# EAGLE design telemetry box (EAGLE 6.3)
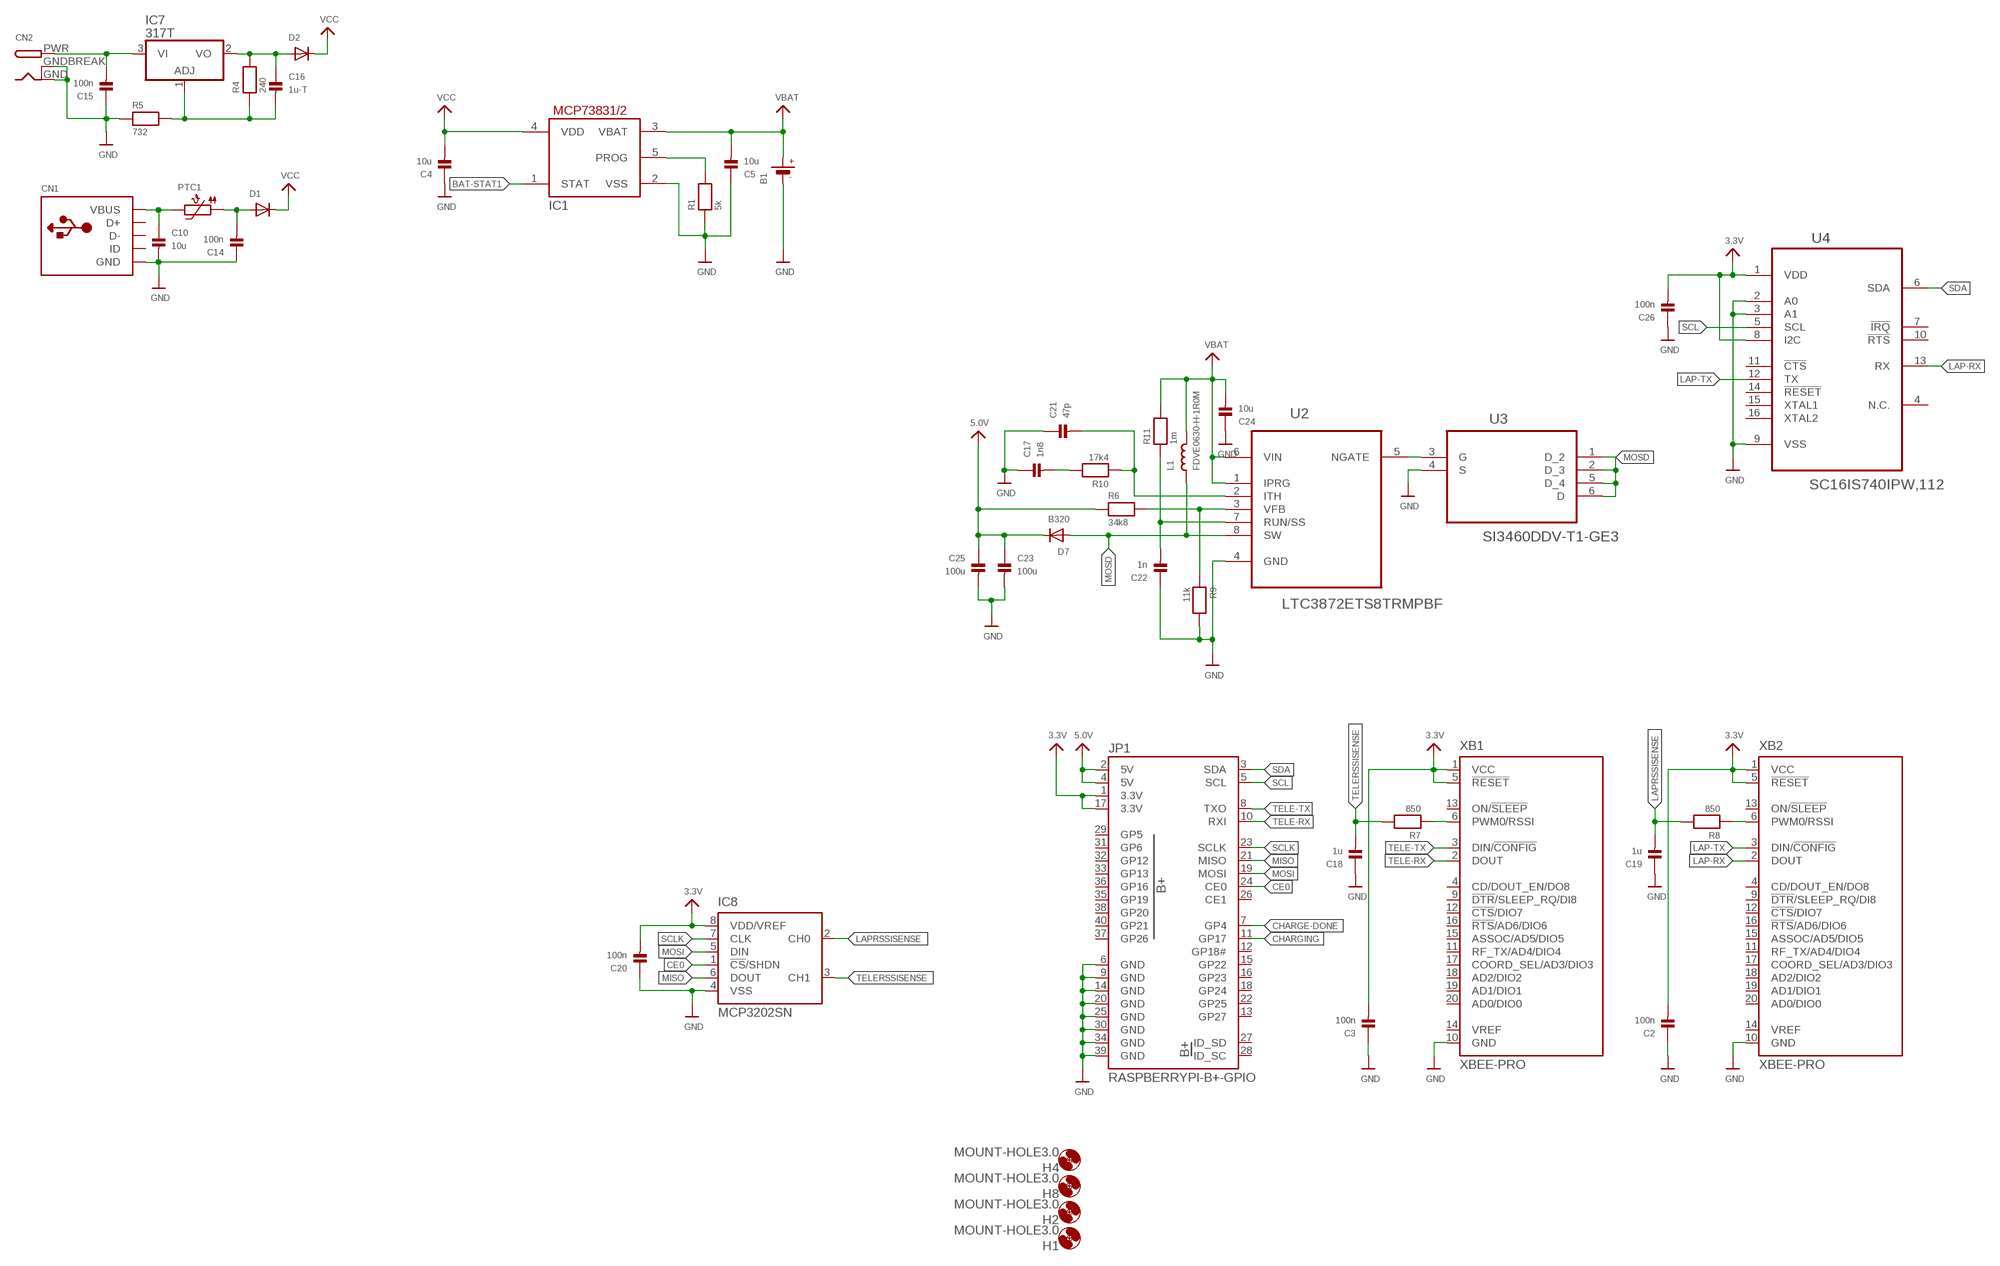
[diagram p0: schematic, sheet 1]

## Parts
B1  BATTERY  [JSTPH2]
C2  100n  CAP_CERAMIC_0603  [_0603]
C3  100n  CAP_CERAMIC_0603  [_0603]
C4  10u  CAP_CERAMIC_0805  [_0805]
C5  10u  CAP_CERAMIC_0805  [_0805]
C10  10u  CAP_CERAMIC_0805  [_0805]
C14  100n  CAP_CERAMIC_0603  [_0603]
C15  100n  CAP_CERAMIC_0603  [_0603]
C16  1u-T  CAP_CERAMIC_0603  [_0603]
C17  1n8  CAP_CERAMIC_0603  [_0603]
C18  1u  CAP_CERAMIC_0603  [_0603]
C19  1u  CAP_CERAMIC_0603  [_0603]
C20  100n  CAP_CERAMIC_0603  [_0603]
C21  47p  CAP_CERAMIC_0603  [_0603]
C22  1n  CAP_CERAMIC_0603  [_0603]
C23  100u  CAP_CERAMIC1206  [1206]
C24  10u  CAP_CERAMIC_0805  [_0805]
C25  100u  CAP_CERAMIC1206  [1206]
C26  100n  CAP_CERAMIC_0603  [_0603]
CN1  USBMINIB  [USB-MINIB]
CN2  DCBARRELPTH  [DCJACK_2MM_PTH]
D1  DIODESOT23_WAVE  [SOT23-W]
D2  DIODESOT23_WAVE  [SOT23-W]
D7  B320  DIODESMA  [SMADIODE]
H1  MOUNT-HOLE3.0  [3,0]
H2  MOUNT-HOLE3.0  [3,0]
H4  MOUNT-HOLE3.0  [3,0]
H8  MOUNT-HOLE3.0  [3,0]
IC1  MCP73831/OT  [SOT23-5L]
IC7  317T  [TO220H]
IC8  MCP3202SN  [SO-08]
JP1  RASPBERRYPI-B+-GPIO  [2X20-SHROUDED]
L1  FDVE0630-H-1R0M  INDUCTORTDK_SLF6045  [INDUCTOR_6X6MM_TDK_SLF6045]
PTC1  PTC1206  [1206]
R1  5k  RESISTOR_0603  [_0603]
R4  240  RESISTOR_0603  [_0603]
R5  732  RESISTOR_0603  [_0603]
R6  34k8  RESISTOR_0603  [_0603]
R7  850  RESISTOR_0603  [_0603]
R8  850  RESISTOR_0603  [_0603]
R9  11k  RESISTOR_0603  [_0603]
R10  17k4  RESISTOR_0603  [_0603]
R11  1m  RESISTOR_0603  [_0603]
U2  LTC3872ETS8TRMPBF  [SOT65P280X100-8N]
U3  SI3460DDV-T1-GE3  SI3457CDV-T1-GE3  [SOT95P285X110-6N]
U4  SC16IS740IPW,112  [SOP65P640X110-16N]
XB1  XBEE-PRO  [XBEE-PRO]
XB2  XBEE-PRO  [XBEE-PRO]

## Nets
3.3V: C2.2 C3.2 C20.2 C26.2 IC8.8(VDD/VREF) JP1.1(3.3V) JP1.17(3.3V) U4.1(VDD) U4.8(I2C) XB1.1(VCC) XB1.5(!RESET) XB2.1(VCC) XB2.5(!RESET)
5.0V: C23.1 C25.1 D7.C JP1.2(5V) JP1.4(5V) R6.1
BAT-STAT1: IC1.1(STAT)
CE0: IC8.1(!CS!/SHDN) JP1.24(CE0)
CHARGE-DONE: JP1.7(GP4)
CHARGING: JP1.11(GP17)
GND: B1.1(-) C2.1 C3.1 C4.1 C5.1 C10.2 C14.1 C15.1 C17.1 C18.1 C19.1 C20.1 C21.1 C22.1 C23.2 C24.1 C25.2 C26.1 CN1.GND CN2.GND CN2.GNDBREAK IC1.2(VSS) IC8.4(VSS) JP1.6(GND) JP1.9(GND) JP1.14(GND) JP1.20(GND) JP1.25(GND) JP1.30(GND) JP1.34(GND) JP1.39(GND) R1.1 R5.1 R9.2 U2.4(GND) U3.4(S) U4.2(A0) U4.3(A1) U4.9(VSS) XB1.10(GND) XB2.10(GND)
LAP-RX: U4.13(RX) XB2.2(DOUT)
LAP-TX: U4.12(TX) XB2.3(DIN/!CONFIG)
LAPRSSISENSE: C19.2 IC8.2(CH0) R8.2
MISO: IC8.6(DOUT) JP1.21(MISO)
MOSD: D7.A L1.P$1 U2.8(SW) U3.1(D_2) U3.2(D_3) U3.5(D_4) U3.6(D)
MOSI: IC8.5(DIN) JP1.19(MOSI)
N$2: IC1.5(PROG) R1.2
N$17: C10.1 CN1.VBUS PTC1.2
N$18: C16.2 IC7.1(ADJ) R4.1 R5.2
N$19: R6.2 R9.1 U2.3(VFB)
N$20: C16.1 D2.1(A) IC7.2(VO) R4.2
N$21: C14.2 D1.1(A) PTC1.1
N$22: C15.2 CN2.PWR IC7.3(VI)
N$23: R7.1 XB1.6(PWM0/RSSI)
N$24: R8.1 XB2.6(PWM0/RSSI)
N$25: U2.5(NGATE) U3.3(G)
N$26: C17.2 R10.2
N$27: C21.2 R10.1 U2.2(ITH)
N$29: C22.2 R11.1 U2.7(RUN/SS)
SCL: JP1.5(SCL) U4.5(SCL)
SCLK: IC8.7(CLK) JP1.23(SCLK)
SDA: JP1.3(SDA) U4.6(SDA)
TELE-RX: JP1.10(RXI) XB1.2(DOUT)
TELE-TX: JP1.8(TXO) XB1.3(DIN/!CONFIG)
TELERSSISENSE: C18.2 IC8.3(CH1) R7.2
VBAT: B1.2(+) C5.2 C24.2 IC1.3(VBAT) L1.P$2 R11.2 U2.1(IPRG) U2.6(VIN)
VCC: C4.2 D1.3(C) D2.3(C) IC1.4(VDD)
Unconnected: CN1.D+ CN1.D- CN1.ID JP1.12(GP18#) JP1.13(GP27) JP1.15(GP22) JP1.16(GP23) JP1.18(GP24) JP1.22(GP25) JP1.26(CE1) JP1.27(ID_SD) JP1.28(ID_SC) JP1.29(GP5) JP1.31(GP6) JP1.32(GP12) JP1.33(GP13) JP1.35(GP19) JP1.36(GP16) JP1.37(GP26) JP1.38(GP20) JP1.40(GP21) U4.4(N.C.) U4.7(!IRQ) U4.10(!RTS) U4.11(!CTS) U4.14(!RESET) U4.15(XTAL1) U4.16(XTAL2) XB1.4(CD/DOUT_EN/DO8) XB1.9(!DTR!/SLEEP_RQ/DI8) XB1.11(RF_TX/AD4/DIO4) XB1.12(!CTS!/DIO7) XB1.13(ON/!SLEEP) XB1.14(VREF) XB1.15(ASSOC/AD5/DIO5) XB1.16(!RTS!/AD6/DIO6) XB1.17(COORD_SEL/AD3/DIO3) XB1.18(AD2/DIO2) XB1.19(AD1/DIO1) XB1.20(AD0/DIO0) XB2.4(CD/DOUT_EN/DO8) XB2.9(!DTR!/SLEEP_RQ/DI8) XB2.11(RF_TX/AD4/DIO4) XB2.12(!CTS!/DIO7) XB2.13(ON/!SLEEP) XB2.14(VREF) XB2.15(ASSOC/AD5/DIO5) XB2.16(!RTS!/AD6/DIO6) XB2.17(COORD_SEL/AD3/DIO3) XB2.18(AD2/DIO2) XB2.19(AD1/DIO1) XB2.20(AD0/DIO0)

## Library data of the parts
B1 = microbuilder:BATTERY: CR1220 SMT - Digikey: 3001K-ND
C2-C5 C10 C14-C26 = microbuilder:CAP_CERAMIC: Ceramic Capacitors 0402 - 0402 Surface Mount Capacitors 16pF 50V 5% [Digikey: 445-4899-2-ND] 18pF 50V 5% [Digikey: 490-1281-2-ND] 22pF 50V 5% [Digikey: 490-1283-2-ND] 68pF 50V 5% [Digikey: 490-1289-2-ND] 0.1uF 10V 10% [Digikey: 490-1318-2-ND] 1.0uF 6.3V 10% [Digikey: 490-1320-2-ND] 0603 - 0603 Surface Mount Capacitors 16 pF 50V 5% [Digikey: 445-5051-2-ND] 22 pF 50V [Digikey: PCC220ACVTR-ND] 33 pF 50V 5% [Digikey: 490-1415-1-ND] 56pF 50V 5% [Digikey: 490-1421-1-ND] 220pF 50V 5% [Digikey: 445-1285-1-ND] 680 pF 50V 2200 pF 50V 5% C0G [Digikey: 445-1297-1-ND] 5600 pF 100V 5% X7R [Digikey: 478-3711-1-ND] 0.1 µF 25V 10% [Digikey: PCC2277TR-ND] 0.22 µF 16V 10% X7R [Digikey: 445-1318-1-ND] 1.0 µF 25V 10% [Digikey: 445-5146-2-ND] 0603 - RF Specific 3pF 250V +/-0.1pF RF [Digikey: 712-1347-1-ND] 18 pF 250V 5% [Digikey: 478-3505-1-ND or 712-1322-1-ND] 56 pF 250V 5% C0G RF [Digikey: 490-4867-1-ND] 68 pF 250V RF [Digikey: 490-4868-1-ND] 0805 - 0805 Surface Mount Capacitors 220 pF 250V 2% RF Ceramic Capacitor [Digikey: 712-1398-1-ND] 1000 pF 50V 2% NP0 Ceramic Capacitor [Digikey: 478-3760-1-ND] 0.1 µF 25V 10% Ceramic Capacitor [Digikey: PCC1828TR-ND] 1.0 µF 16V 10% Ceramic Capacitor[Digikey: 490-1691-2-ND] 10.0 µF 10V 10% Ceramic Capacitor[Digikey: 709-1228-1-ND] 10.0 uF 16V 10% Ceramic Capacitor [Digikey: 478-5165-2-ND] 47 uF 6.3V 20% Ceramic Capacitor [Digikey: 587-1779-1-ND or 399-5506-1-ND] 1206 - 1206 Surface Mount Capacitors 47uF 10V 20% Ceramic Capacitor [Digikey: 490-5528-1-ND or 399-5508-1-ND or 445-6010-1-ND] 100uF 6.3V -20%, +80% Y5V Ceramic Capacitor (Digikey: 490-4512-1-ND, Mouser: 81-GRM31CF50J107ZE1L)
CN1 = adafruit:USB: USB Connectors USBMINIB - Surface Mount Female Mini-B USB Connector 4UConnector: 06564 By microbuilder.eu Thru-hole RA Female Mini-B USB Connector 4UConnector: 18732 By ladyada.net
CN2 = adafruit:DCBARREL: 2.0mm DC Barrel Jack DCJACK_2MM_PTH - Through Hole Jack (4UConnector: 05537)
D1 D2 D7 = adafruit:DIODE: Diode SMADIODE - SMA Surface Mount Package 20V 1A Schottky Diode Digikey: 641-1014-6-ND DO-1N4148 - Through Hole Small Current Diode SOD-123 20V 1 A (.5mV Vf) Schottky Diode - Digikey: MBRX120TPMSCT-ND SOD-323 10V 570mA (.38mV Vf, 3ns) Schottky Diode - Digikey: ZLLS410CT-ND SOD-523 30V 30mA Schottky Diode (RB751S-40TE61) - Digikey: RB751S-40TE61CT-ND SOT23-R/W - SOT23 Package (R = Solder Paste/Reflow Ovens, W = Hand-Soldering) BAT54Film 40V 300mA - Digikey: 497-7162-1-ND
H1 H2 H4 H8 = holes:MOUNT-HOLE: MOUNTING HOLE with drill center marker
IC1 = adafruit:MCP73831: MCP73831/2 Miniature Single-Cell, Fully Integrated Li-Ion, Li-Polymer Charge Management Controllers. Nice and small simple lipoly charge controller, with adjustable current and status output (LED) http://www.ladyada.net/library/pcb/eaglelibrary.html
IC7 = linear:*317: Positive VOLTAGE REGULATOR
IC8 = microchip:MCP3202: 2.7V Dual Channel 12-Bit A/D Converter with SPI Serial Interface Source: http://ww1.microchip.com/downloads/en/DeviceDoc/21034D.pdf; MF: MICROCHIP; MPN: MCP3202-CI/SN; OC_FARNELL: 1196803; OC_NEWARK: 19C7207
JP1 = SparkFun-Boards:RASPBERRYPI-B+-GPIO: Raspberry Pi B+ GPIO Header 2x20 pin connector
L1 = microbuilder:INDUCTOR: Inductors 0603: 10nH Ceramic Inductor - microwire antenna/RF (Digikey: 712-1434-2-ND) 0805: 560nH Ceramic Inductor - RF (Digikey: 553-1047-1-ND) 270nH Ceramic Inductor - Q = 40@250MHz, +-5%, 1 Ohm DC Resistance (Digikey: 535-10506-2-ND) 1007 (2518 Metric) SMT: 10µH 10% 250mOhm 820mA 1007 Inductor (Digikey: 587-2189-1-ND) 22µH 10% 500mOhm 580mA 1007 Inductor (Digikey: 587-2190-1-ND) 47µH 10% 950mOhm 420mA 1007 Inductor (Digikey: 587-2191-1-ND) 47µH 5% 100mOhm 1A 1008 Inductor (Digikey: 732-1816-1-ND) 5.0x5.0mm (Taiyo Yuden NR5040 Series) 6.8µH 20% 2.3A 64mOhm Inductor (Digikey: 587-2374-2-ND) 5.0x5.0mm (TDK VLC5045 Series) 4.7µH 20% 3.3A 34mOhm Inductor (Digikey: 445-6526-1-ND) 6.8µH 20% 2.7A 46mOhm Inductor (Digikey: 445-6527-1-ND) 6.0x6.0mm (TDK VLC6045 Series) 4.7µH 20% 3.8A 27mOhm Inductor (Digikey: 445-6538-2-ND) 6.8µH 20% 3A 41mOhm Inductor (Digikey: 445-6540-1-ND) 6.2µH 30% 2.2A 45mOhm Inductor (Digikey: SRR5028-6R2YCT-ND) - Not TDK VLC6045 but footprint should match 6.0x6.0mm (TDK SLF6045 Series) 6.8uH 30% 2A 33mOhm Inductor (Digikey: 445-4572-1-ND, Mouser: 810-SLF645T6R8N2R0PF)
PTC1 = microbuilder:PTC: PTC (Resettable Fuse) 1206 Package 250mA PTC (16V Max, Time-to-Trip: 0.08s) - Digikey: F2110CT-ND 1210 Package 100mA PTC (30V Max, Time-to-Trip: 0.6s) - Digikey: MF-USMF010-2CT-ND 1812 Package 750mA PTC (24V Max, Time-to-Trip: 0.2s) - Digikey: MF-MSMF075/24-2CT-ND
R1 R4-R11 = microbuilder:RESISTOR: Resistors 0402 - 0402 Surface Mount Package 22 Ohm 1% 1/16W [Digikey: 311-22.0LRTR-ND] 33 Ohm 5% 1/16W 1.0K 5% 1/16W 1.5K 5% 1/16W 2.0K 1% 1/16W 10.0K 1% 1/16W [Digikey: 311-10.0KLRTR-ND] 10.0K 5% 1/16W [Digikey: RMCF0402JT10K0TR-ND] 12.1K 1% 1/16W [Digikey: 311-22.0LRTR-ND] 100.0K 5% 1/16W 0603 - 0603 Surface Mount Package 0 Ohm 1/10 Watt 1% Resistor 15 Ohm 1/10 Watt 1% Resistor 33 Ohm 1/10 Watt 1% Resistor 49.9 Ohm 1/10 Watt 1% Resistor 100 Ohm 1/10 Watt 1% Resistor 150 Ohm 1/10 Watt 1% Resistor 240 Ohm 1/10 Watt 1% Resistor 390 Ohm 1/10 Watt 1% Resistor 560 Ohm 1/10 Watt 1% Resistor 680 Ohm 1/10 Watt 1% Resistor 750 Ohm 1/10 Watt 1% Resistor 1.0K Ohm 1/10 Watt 1% Resistor 1.5K Ohm 1/10 Watt 1% Resistor 2.0K Ohm 1/10 Watt 1% Resistor 2.2K Ohm 1/10 Watt 1% Resistor 3.3K Ohm 1/10 Watt 1% Resistor 4.7K Ohm 1/10 Watt 1% Resistor 10.0K Ohm 1/10 Watt 1% Resistor 12.0K Ohm 1/10 Watt 1% Resistor 12.1K Ohm 1/10 Watt 1% Resistor 20.0K Ohm 1/10 Watt 1% Resistor 33.0K Ohm 1/10 Watt 1% Resistor 100.0K Ohm 1/10 Watt 1% Resistor 0805 - 0805 Surface Mount Package 0 Ohm 1/8 Watt 1% Resistor 33 Ohm 1/8 Watt 1% Resistor 100 Ohm 1/8 Watt 1% Resistor 150 Ohm 1/8 Watt 1% Resistor 200 Ohm 1/8 Watt 1% Resistor 240 Ohm 1/8 Watt 1% Resistor 330 Ohm 1/8 Watt 1% Resistor 390 Ohm 1/8 Watt 1% Resistor 470 Ohm 1/8 Watt 1% Resistor 1.0K Ohm 1/8 Watt 1% Resistor 1.5K Ohm 1/8 Watt 1% Resistor 2.0K Ohm 1/8 Watt 1% Resistor 4.7K Ohm 1/8 Watt 1% Resistor 5.1K Ohm 1/8 Watt 1% Resistor 5.6K Ohm 1/8 Watt 1% Resistor 10.0K Ohm 1/8 Watt 1% Resistor 22.0K Ohm 1/8 Watt 1% Resistor 33.0K Ohm 1/8 Watt 1% Resistor 100K Ohm 1/8 Watt 1% Resistor 1206 - 1206 Surface Mount Package 2012 - 2010 Surface Mount Package 0.11 Ohm 1/2 Watt 1% Resistor - Digikey: RHM.11UCT-ND
U2 = LTC_By_element14_Batch_1:LTC3872ETS8TRMPBF: DC/DC Controller; MPN: LTC3872ETS8#TRMPBF; OC_FARNELL: 1556409; OC_NEWARK: 56M8617; PACKAGE: SOT-23-8; SUPPLIER: LINEAR TECHNOLOGY
U3 = Vishay_By_element14_Batch_1:SI3457CDV-T1-GE3: N-Channel 30-V (D-S) MOSFET; MPN: SI3457CDV-T1-GE3; OC_FARNELL: 1840420; OC_NEWARK: 90R9127; PACKAGE: TSOP-6; SUPPLIER: Vishay Siliconix
U4 = NXP-SC16IS740IPW-112:SC16IS740IPW,112: IC, UART FIFO 5MBPS 3.6V 16TSSOP; MPN: SC16IS740IPW,112; OC_FARNELL: 2101308; OC_NEWARK: 70R8982; PACKAGE: 16TSSOP; SUPPLIER: NXP
XB1 XB2 = microbuilder:XBEE: XBee (TM) /XBee-PRO(TM) OEM RF Modules Source: MaxStream, Inc. xbee_productmanual.pdf

## Board
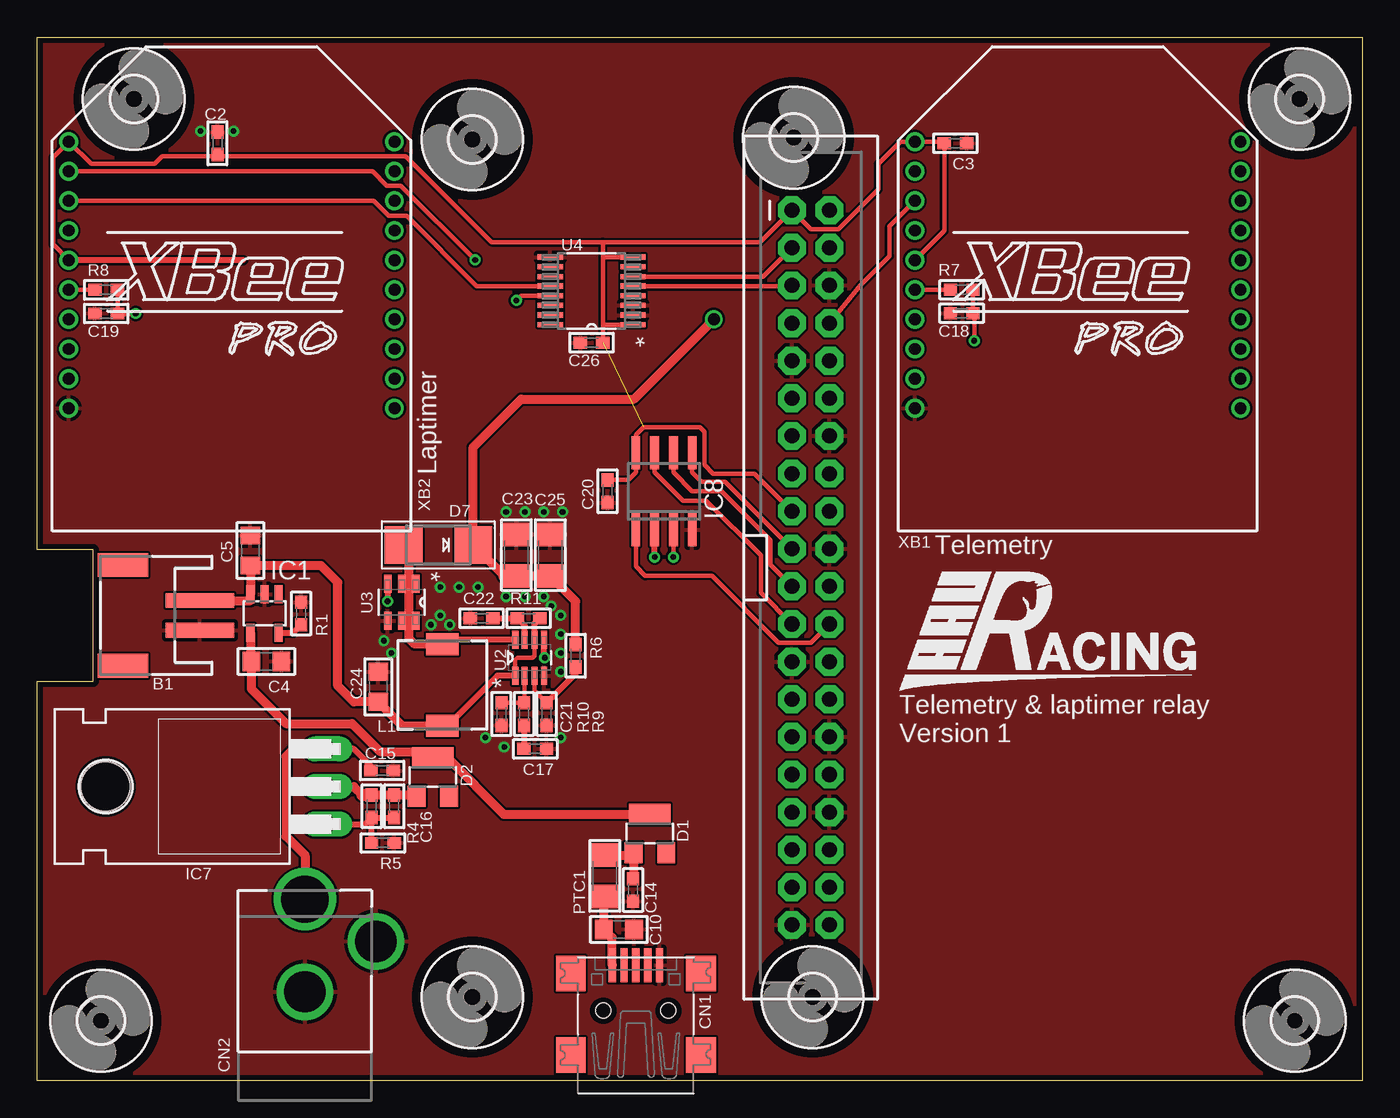
[diagram p1: board, top side]
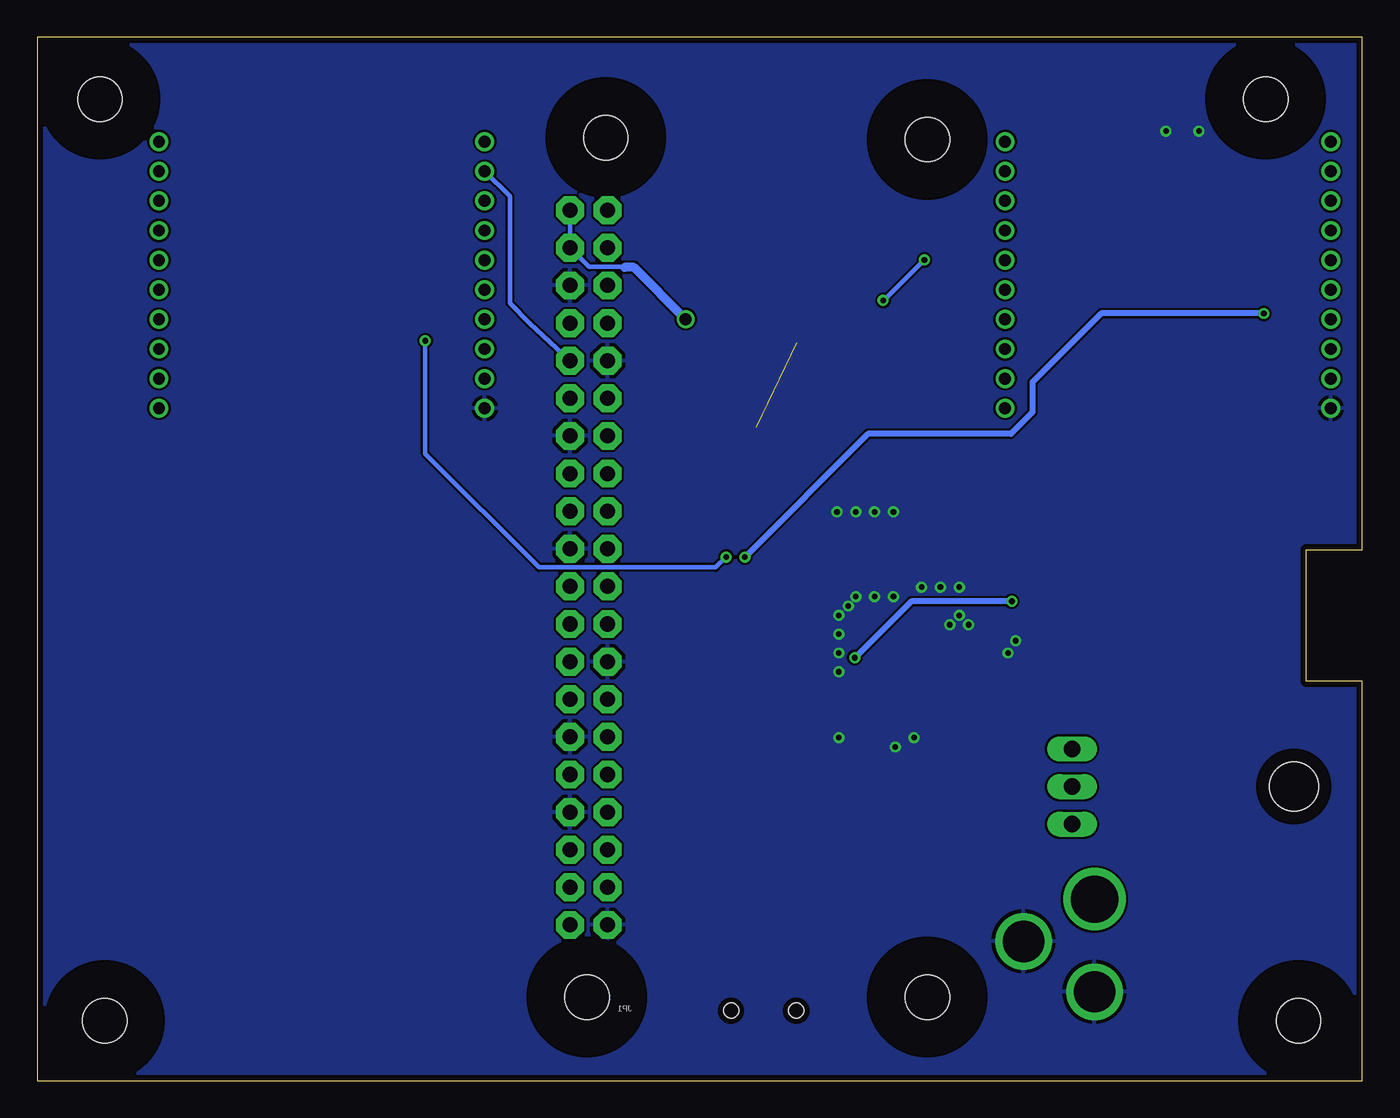
[diagram p2: board, bottom side, seen from below]

Size 89.53 x 70.48 mm. Coordinates in mm from the lower left corner, seen from the top.
Outline: 0,0 0,26.99 3.81,26.99 3.81,35.88 0,35.88 0,70.48 89.53,70.48 89.53,0 0,0
Copper layers (1*16): Top 0.0356mm / dielectric 1.5011mm / Bottom 0.0356mm
Design rules "LaenPCBOrder": minimum track width 6mil, minimum drill 13mil, track to track 6mil, track to pad 6mil, pad to pad 6mil, via to via 6mil, smd to smd 6mil, copper to edge 15mil, drill to drill 6mil, minimum pad ring 7mil, minimum via ring 7mil, stop-mask expansion 3mil, vias tented up to drill 0mil, thermal gap 10mil

### Footprints (pad centres in the part's own frame; a part is rotated, then mirrored left to right if it is on the bottom)
JSTPH2 = smd 1 x 4.6: 1 -1,-3.7; 2 1,-3.7 | smd 1.6 x 3.4: NC1 -3.4,1.5; NC2 3.4,1.5
_0603 = smd 0.9 x 0.8: 1 -0.762,0; 2 0.762,0
_0805 = smd 1.2 x 1.3: 1 -1.016,0; 2 1.016,0
1206 = smd 1.6 x 1.8: 1 -1.4,0; 2 1.4,0
USB-MINIB = smd 0.5 x 2.308: D+ 0,4.064; D- -0.8,4.064; GND 1.6,4.064; ID 0.8,4.064; VBUS -1.6,4.064 | smd 2 x 2.4: GND1 -4.4,-2; GND2 -4.4,3.5; GND3 4.4,3.5; GND4 4.4,-2 | hole 1: -2.2,1; 2.2,1
DCJACK_2MM_PTH = drill 2.8: GND 0,7.35; GNDBREAK 4.8,10.75 | drill 3.2: PWR 0,13.6
SOT23-W = smd 1.2 x 1.4: 1 -1.1,-1.3; 2 1.1,-1.3 | smd 2.8 x 1.4: 3 0,1.3
SMADIODE = smd 2.54 x 2.54: A 2.349,0; C -2.349,0
3,0 = hole 3: 0,0
SOT23-5L = smd 0.55 x 1.2: 1 -0.95,-1.3; 2 0,-1.3; 3 0.95,-1.3; 4 0.95,1.3; 5 -0.95,1.3
TO220H = drill 1.118 long: 1 -2.54,-10.16; 2 0,-10.16; 3 2.54,-10.16 | hole 3.302: 0,4.826
SO-08 = smd 0.6 x 2.2: 1 -1.905,-2.6; 2 -0.635,-2.6; 3 0.635,-2.6; 4 1.905,-2.6; 5 1.905,2.6; 6 0.635,2.6; 7 -0.635,2.6; 8 -1.905,2.6
2X20-SHROUDED = drill 1.016 pad 1.88 octagon: 1 -1.27,24.13; 2 1.27,24.13; 3 -1.27,21.59; 4 1.27,21.59; 5 -1.27,19.05; 6 1.27,19.05; 7 -1.27,16.51; 8 1.27,16.51; 9 -1.27,13.97; 10 1.27,13.97; 11 -1.27,11.43; 12 1.27,11.43; 13 -1.27,8.89; 14 1.27,8.89; 15 -1.27,6.35; 16 1.27,6.35; 17 -1.27,3.81; 18 1.27,3.81; 19 -1.27,1.27; 20 1.27,1.27; 21 -1.27,-1.27; 22 1.27,-1.27; 23 -1.27,-3.81; 24 1.27,-3.81; 25 -1.27,-6.35; 26 1.27,-6.35; 27 -1.27,-8.89; 28 1.27,-8.89; 29 -1.27,-11.43; 30 1.27,-11.43; 31 -1.27,-13.97; 32 1.27,-13.97; 33 -1.27,-16.51; 34 1.27,-16.51; 35 -1.27,-19.05; 36 1.27,-19.05; 37 -1.27,-21.59; 38 1.27,-21.59; 39 -1.27,-24.13; 40 1.27,-24.13
INDUCTOR_6X6MM_TDK_SLF6045 = smd 1.5 x 2.2: P$1 -2.75,0; P$2 2.75,0
SOT65P280X100-8N = smd 1.219 x 0.406: 1 -1.219,0.965; 2 -1.219,0.33; 3 -1.219,-0.33; 4 -1.219,-0.965; 5 1.219,-0.965; 6 1.219,-0.33; 7 1.219,0.33; 8 1.219,0.965
SOT95P285X110-6N = smd 1.219 x 0.508: 1 -1.245,0.94; 2 -1.245,0; 3 -1.245,-0.94; 4 1.245,-0.94; 5 1.245,0; 6 1.245,0.94
SOP65P640X110-16N = smd 1.702 x 0.356: 1 -2.794,2.286; 2 -2.794,1.626; 3 -2.794,0.965; 4 -2.794,0.33; 5 -2.794,-0.33; 6 -2.794,-0.965; 7 -2.794,-1.626; 8 -2.794,-2.286; 9 2.794,-2.286; 10 2.794,-1.626; 11 2.794,-0.965; 12 2.794,-0.33; 13 2.794,0.33; 14 2.794,0.965; 15 2.794,1.626; 16 2.794,2.286
XBEE-PRO = drill 0.8 pad 1.27: 1 -11,9; 2 -11,7; 3 -11,5; 4 -11,3; 5 -11,1; 6 -11,-1; 7 -11,-3; 8 -11,-5; 9 -11,-7; 10 -11,-9; 11 11,-9; 12 11,-7; 13 11,-5; 14 11,-3; 15 11,-1; 16 11,1; 17 11,3; 18 11,5; 19 11,7; 20 11,9

### Placement (x,y rotation side)
B1  7.3,31.43 90 top
C2  12.19,63.31 270 top
C3  62.04,63.31 180 top
C4  15.49,28.32 180 top
C5  14.41,35.81 270 top
C10  39.31,10.22 0 top
C14  40.26,12.89 90 top
C15  23.3,20.95 180 top
C16  24.13,18.54 270 top
C17  33.66,22.42 180 top
C18  62.46,51.83 0 top
C19  4.67,51.82 0 top
C20  38.54,39.81 90 top
C21  31.37,24.77 90 top
C22  30.04,31.24 0 top
C23  32.39,35.5 90 top
C24  23.05,26.61 270 top
C25  34.67,35.5 90 top
C26  37.47,49.85 0 top
CN1  40.45,3.75 0 top
CN2  18.1,-1.33 0 top
D1  41.4,16.7 0 top
D2  26.73,20.51 0 top
D7  27.11,36.2 180 top
H1  51.12,63.69 0 top
H2  29.4,63.56 0 top
H3  MOUNT-HOLE3.0  [3,0]  29.4,5.65 0 top
H4  52.39,5.65 0 top
H5  MOUNT-HOLE3.0  [3,0]  4.32,4.06 0 top
H6  MOUNT-HOLE3.0  [3,0]  84.96,4.06 0 top
H7  MOUNT-HOLE3.0  [3,0]  85.28,66.29 0 top
H8  6.54,66.29 0 top
IC1  15.37,31.56 180 top
IC7  9.46,19.88 90 top
IC8  42.35,39.81 0 top
JP1  52.26,34.66 0 top
L1  27.37,26.73 270 top
PTC1  38.35,13.84 270 top
R1  17.84,31.56 270 top
R4  22.61,18.54 90 top
R5  23.37,16.07 180 top
R6  36.39,28.7 270 top
R7  62.46,53.42 0 top
R8  4.67,53.41 0 top
R9  34.42,24.77 270 top
R10  32.89,24.77 270 top
R11  33.21,31.24 0 top
U2  33.27,28.58 90 top
U3  24.64,32.32 270 top
U4  37.47,53.34 180 top
XB1  70.29,54.42 0 top
XB2  13.14,54.42 0 top

### Tracks (layer width: path | path; a pad name or v marks a point on that pad's centre or on a via)
3.3V  (1 unrouted)
  Top 0.305: 38.23,56.64 30.69,56.64 24.91,62.42 12.32,62.42 | 38.23,56.64 48.84,56.64 JP1.1 52.28,57.5 54.13,57.5 56.83,60.2 56.83,61.91 58.34,63.42 XB1.1 61.17,63.42 C3.2 61.28,57.4 XB1.5 | XB2.5 1.08,56.48 1.08,62.35 XB2.1 3.65,61.91 7.94,61.91 8.45,62.42 12.32,62.42 | C26.2 38.23,51.05 | 38.23,51.05 38.23,55.63 | 38.23,55.63 38.23,56.64 | U4.8 38.23,55.63 | U4.1 38.23,51.05 | C20.2 39.94,40.58 40.45,41.08 IC8.8 40.45,43.62 40.96,44.13 44.77,44.13 45.09,43.81 45.09,41.59 45.67,41.01 48.45,41.01 JP1.17 | C2.2 12.32,62.42
  Top 0.406: 13.92,55.42 XB2.5
5.0V  (via drill 0.8)
  Top 0.61: 31.56,34.1 D7.C 29.46,42.8 32.7,46.04 40.32,46.04 v45.72,51.44 | C23.1 C25.1 36.39,32.38 R6.1
  Top 0.813: 31.56,34.1 C23.1
  Bottom 0.305: JP1.2 JP1.4 52.24,54.96 49.88,54.96 49.85,54.93
  Bottom 0.61: v45.72,51.44 49.21,54.93 49.85,54.93
CE0
  Top 0.305: IC8.1 40.45,34.73 41.09,34.1 45.59,34.1 50.1,29.59 52.27,29.59 JP1.24
GND  (via drill 0.38)
  other vias: 31.69,38.42 32.96,38.42 34.23,38.42 35.5,38.42 27.24,33.34 28.51,33.34 29.78,33.34 31.69,32.7 32.96,32.7 34.23,32.7 26.61,30.8 27.24,31.43 27.88,30.8 35.37,27.62 35.37,28.89 35.37,30.16 35.37,31.43 34.73,32.07 35.37,23.18 30.29,23.18 31.56,22.54 23.94,28.89 23.43,29.72 11.05,64.14 13.27,64.14
  pour Top: 0,0 0,26.99 3.81,26.99 3.81,35.88 0,35.88 0,70.48 89.53,70.48 89.53,0
  pour Bottom: 0,0 0,26.99 3.81,26.99 3.81,35.88 0,35.88 0,70.48 89.53,70.48 89.53,0
LAP-RX  (via drill 0.38)
  Top 0.305: v29.59,55.44 24.57,60.45 23.62,60.45 22.65,61.42 XB2.2 | U4.13 32.69,53.01 v32.39,52.7
  Bottom 0.305: v32.39,52.7 32.32,52.7 v29.59,55.44
LAP-TX
  Top 0.305: U4.12 29.7,53.67 24.95,58.42 23.75,58.42 22.75,59.42 XB2.3
LAPRSSISENSE  (via drill 0.38)
  Top 0.305: R8.2 C19.2
  Top 0.406: C19.2 v6.67,51.82 | v41.72,35.37 IC8.2
  Bottom 0.406: v6.67,51.82 17.65,51.82 22.29,47.18 22.29,45.15 23.75,43.69 33.4,43.69 v41.72,35.37
MISO
  Top 0.305: IC8.6 42.99,41.08 44.26,39.81 46.23,39.81 49.53,36.51 49.53,34.85 JP1.21
MOSD
  Top 0.406: U3.5 25.11,31.08 U3.6 | U3.2 U3.1 25.42,33.72 25.15,33.72 | U2.8 27.37,29.79 L1.P$1
  Top 0.61: L1.P$1 25.51,29.48 25.15,29.84 25.15,31.11 25.15,33.72 25.15,35.81 arc90 D7.A
  Top 0.813: 25.11,31.08 arc90 25.15,31.11
MOSI
  Top 0.305: IC8.5 44.26,41.08 44.89,40.45 46.47,40.45 JP1.19
N$2
  Top 0.406: IC1.5 17.31,30.26 R1.2
N$17
  Top 0.61: CN1.VBUS 38.85,9.66 C10.1 38.29,12.38 PTC1.2
N$18
  Top 0.406: IC7.1 22.16,17.34 R4.1 | R4.1 C16.2 | R5.2 R4.1
N$19
  Top 0.305: U2.3 33.6,26.34 R9.1
  Top 0.406: R6.2 36.39,27.5 R9.1
N$20
  Top 0.61: R4.2 C16.1 25.63,19.3 D2.1 | IC7.2 21.4,19.88 21.97,19.3
  Top 0.813: 21.97,19.3 R4.2
N$21
  Top 0.61: PTC1.1 40.14,15.24 D1.1 40.3,13.7 C14.2
N$22
  Top 0.406: C15.2 22.54,21.27 21.4,22.42 19.05,22.42
  Top 0.61: 19.05,22.42 17.34,22.42 16.83,21.91 16.83,16.51 18.1,15.24 CN2.PWR
  Top 0.813: IC7.3 19.05,22.42
N$23
  Top 0.305: XB1.6 R7.1
N$24
  Top 0.305: XB2.6 2.14,53.41 R8.1
N$25  (via drill 0.38)
  Top 0.406: U3.3 23.69,33.57 v23.69,32.38 | v34.29,28.58 34.24,28.63 U2.5
  Bottom 0.406: v23.69,32.38 30.48,32.38 v34.29,28.58
N$26
  Top 0.406: R10.2 C17.2
N$27
  Top 0.305: U2.2 32.94,25.58 R10.1 C21.2
N$29
  Top 0.406: C22.2 R11.1 32.94,30.75 U2.7
SCL
  Top 0.305: U4.5 50.95,53.67 JP1.5
SCLK
  Top 0.305: IC8.7 41.72,41.08 43.62,39.18 45.2,39.18 48.89,35.48 48.89,32.94 JP1.23
SDA
  Top 0.305: U4.6 49.05,54.31 JP1.3
TELE-RX
  Bottom 0.305: JP1.10 56.25,51.17 57.59,52.51 57.59,59.72 XB1.2
TELE-TX
  Top 0.305: JP1.8 55.61,53.71 57.59,55.69 57.59,57.72 XB1.3
TELERSSISENSE  (via drill 0.38)
  Top 0.305: R7.2 C18.2 63.31,51.83 v63.31,49.97 | IC8.3 v42.99,35.37
  Bottom 0.305: v42.99,35.37 43.69,34.67 55.63,34.67 63.31,42.35 v63.31,49.97
VBAT
  Top 0.305: U2.1 32.31,28.44 32.45,28.58 33.46,28.58 33.6,28.71 U2.6
  Top 0.406: U2.6 33.6,30.87 R11.2 | U2.1 31.1,27.36 27.94,24.19 27.58,24.19 L1.P$2
  Top 0.61: L1.P$2 24.66,23.98 C24.2 21.4,25.59 20.32,26.67 20.32,33.66 19.18,34.8 C5.2 | B1.2 14.42,32.43 IC1.3 C5.2
  Top 0.813: 27.11,23.73 L1.P$2 | C5.2
VCC
  Top 0.61: IC1.4 14.42,28.38 | C4.2 14.48,26.48 16.83,24.13 21.27,24.13 23.18,22.23 26.32,22.23 D2.3 | 27.72,21.81 31.53,18 D1.3
  Top 0.813: 14.42,28.38 C4.2 | D2.3 27.72,21.81

### Text on the board
tSilk: Laptimer | Telemetry | Telemetry & laptimer relay / Version 1